# EAGLE design central__board (EAGLE 7.6.0)
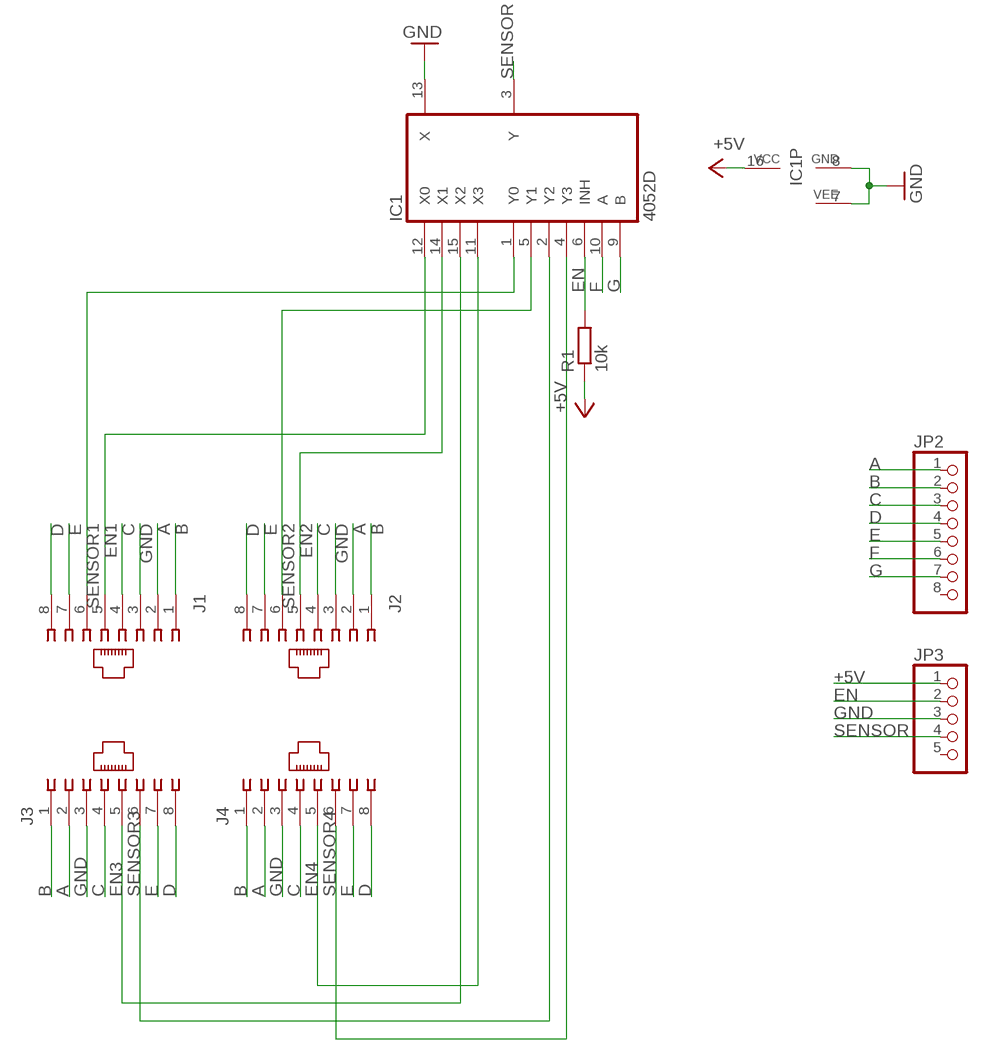
[diagram p0: schematic, sheet 1]

## Parts
IC1  4052D  [SO16]
J1  556416-1  [556416-1]
J2  556416-1  [556416-1]
J3  556416-1  [556416-1]
J4  556416-1  [556416-1]
JP2  PINHD-1X8  [1X08]
JP3  PINHD-1X5  [1X05]
R1  10k  R-EU_M1206  [M1206]

## Nets
+5V: IC1.16(VCC) JP3.1 R1.1
A: J1.2 J2.2 J3.2 J4.2 JP2.1
B: J1.1 J2.1 J3.1 J4.1 JP2.2
C: J1.4 J2.4 J3.4 J4.4 JP2.3
D: J1.8 J2.8 J3.8 J4.8 JP2.4
E: J1.7 J2.7 J3.7 J4.7 JP2.5
EN: IC1.6(INH) JP3.2 R1.2
EN1: IC1.12(X0) J1.5
EN2: IC1.14(X1) J2.5
EN3: IC1.15(X2) J3.5
EN4: IC1.11(X3) J4.5
F: IC1.10(A) JP2.6
G: IC1.9(B) JP2.7
GND: IC1.7(VEE) IC1.8(GND) IC1.13(X) J1.3 J2.3 J3.3 J4.3 JP3.3
SENSOR: IC1.3(Y) JP3.4
SENSOR1: IC1.1(Y0) J1.6
SENSOR2: IC1.5(Y1) J2.6
SENSOR3: IC1.2(Y2) J3.6
SENSOR4: IC1.4(Y3) J4.6
Unconnected: JP2.8 JP3.5

## Library data of the parts
IC1 = 40xx:4052: Dual 4-channel ANALOG MULTIPLEXER
J1-J4 = con-amp:556416-1: AMP connector
JP2 = pinhead:PINHD-1X8: PIN HEADER
JP3 = pinhead:PINHD-1X5: PIN HEADER
R1 = rcl:R-EU_: RESISTOR, European symbol

## Board
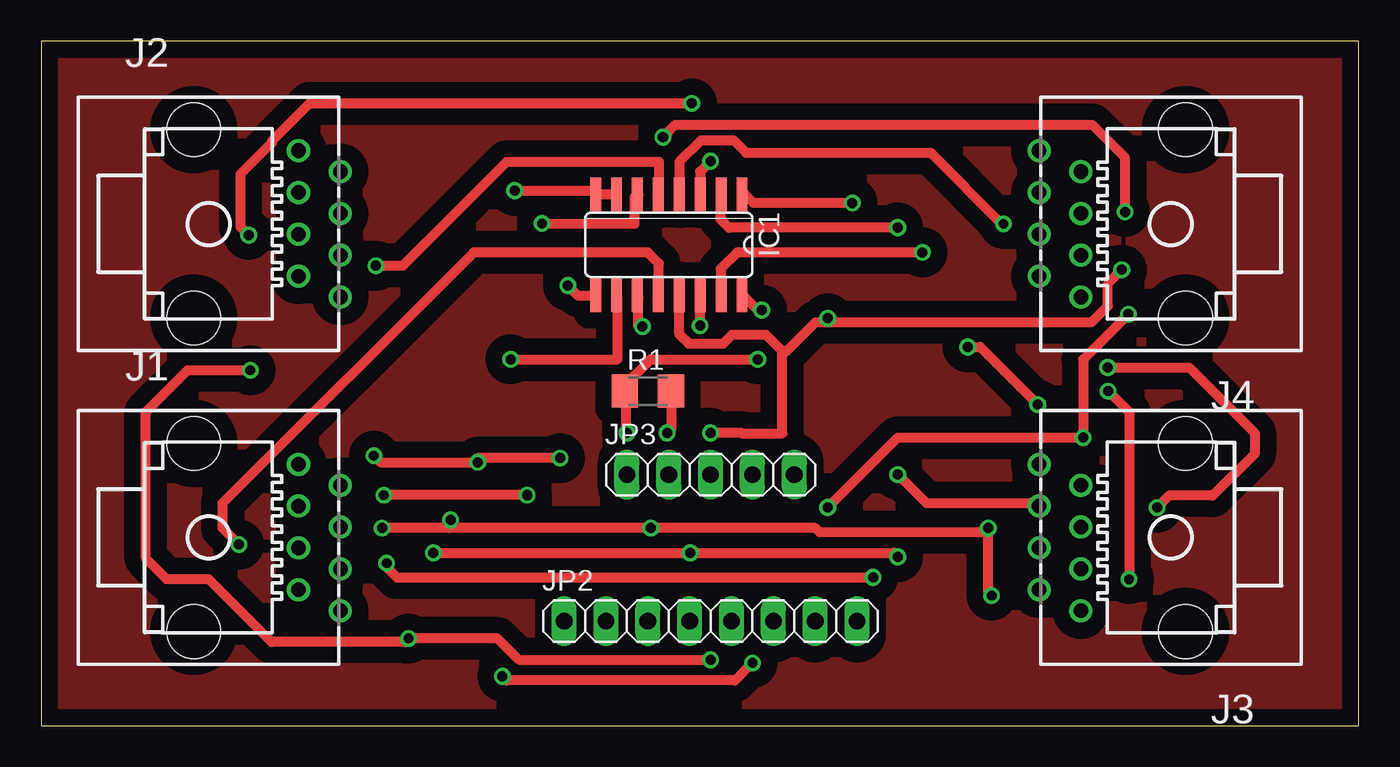
[diagram p1: board, top side]
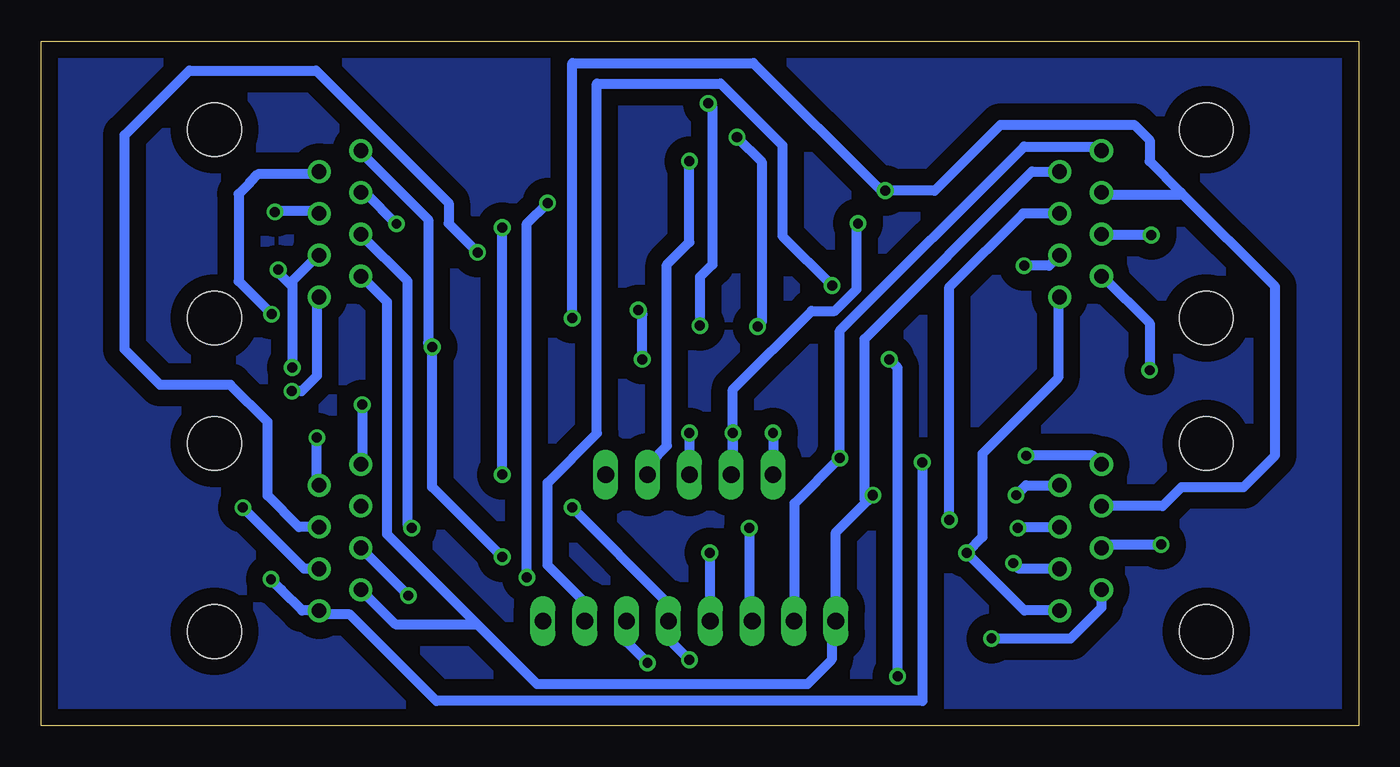
[diagram p2: board, bottom side, seen from below]

Size 79.99 x 41.58 mm. Coordinates in mm from the lower left corner, seen from the top.
Outline: 0,0 79.99,0 79.99,41.58 0,41.58 0,0
Copper layers (1*16): Top 0.035mm / dielectric 1.5mm / Bottom 0.035mm
Design rules "default *": minimum track width 24mil, minimum drill 24mil, track to track 20mil, track to pad 20mil, pad to pad 8mil, via to via 8mil, smd to smd 8mil, copper to edge 40mil, drill to drill 8mil, minimum pad ring 10mil, minimum via ring 8mil, stop-mask expansion 4mil, vias tented up to drill 0mil, thermal gap 10mil

### Footprints (pad centres in the part's own frame; a part is rotated, then mirrored left to right if it is on the bottom)
SO16 = smd 0.66 x 2.032: 1 -4.445,-3.073; 2 -3.175,-3.073; 3 -1.905,-3.073; 4 -0.635,-3.073; 5 0.635,-3.073; 6 1.905,-3.073; 7 3.175,-3.073; 8 4.445,-3.073; 9 4.445,3.073; 10 3.175,3.073; 11 1.905,3.073; 12 0.635,3.073; 13 -0.635,3.073; 14 -1.905,3.073; 15 -3.175,3.073; 16 -4.445,3.073
556416-1 = drill 0.889: 1 -4.445,5.461; 2 -3.175,8.001; 3 -1.905,5.461; 4 -0.635,8.001; 5 0.635,5.461; 6 1.905,8.001; 7 3.175,5.461; 8 4.445,8.001 | hole 3.251: -5.715,-0.889; 5.715,-0.889
1X08 = drill 1.016 long: 1 -8.89,0; 2 -6.35,0; 3 -3.81,0; 4 -1.27,0; 5 1.27,0; 6 3.81,0; 7 6.35,0; 8 8.89,0
1X05 = drill 1.016 long: 1 -5.08,0; 2 -2.54,0; 3 0,0; 4 2.54,0; 5 5.08,0
M1206 = smd 1.6 x 2: 1 -1.4,0; 2 1.4,0

### Placement (x,y rotation side)
IC1  38.1,29.21 180 top
J1  10.16,11.43 270 top
J2  10.16,30.48 270 top
J3  68.58,11.43 90 top
J4  68.58,30.48 90 top
JP2  40.64,6.35 0 top
JP3  40.64,15.24 0 top
R1  36.83,20.32 0 top

### Tracks (layer width: path | path; a pad name or v marks a point on that pad's centre or on a via)
+5V  (via drill 0.6, 0.61)
  Top 0.61: v43.75,25.25 43.5,25.25 42.75,26 IC1.16 | v43.5,22.25 37,22.25 35.25,20.5 R1.1 35.5,20.25 35.5,17.84 v35.56,17.78
  Bottom 0.61: v43.75,25.25 43.5,25 v43.5,22.25 | v35.56,17.78 JP3.1
A  (via drill 0.6, 0.61)
  Top 0.61: v29.5,14 v20.8,14
  Bottom 0.61: J4.2 60.5,27.25 59,25.75 59,11.64 53.52,6.17 | 29.88,13.62 31.75,11.75 JP2.1 32,6.25 32,4 33.46,2.54 49.9,2.54 53.52,6.17 | 29.88,13.62 v29.5,14 | 29.88,13.62 30,13.75 30,23.5 19.84,33.66 J2.2 | v20.8,14 20.2,14.61 J1.2 | J3.2 58.49,6.17 53.52,6.17
B  (via drill 0.6, 0.61)
  Top 0.61: v31.5,16.25 26.5,16.25 v26.5,16 20.6,16 v20.2,16.4 | v64.77,20.32 66.04,19.05 v66.04,8.89
  Bottom 0.61: J4.1 63.25,26 63.25,21.25 64.18,20.32 v64.77,20.32 | JP2.2 34.25,6.5 34.25,13.5 v31.5,16.25 31.5,24 20.32,35.18 15.88,35.18 J2.1 | v26.5,16 26.5,1.5 56,1.5 61.25,6.75 63,6.75 J3.1 63.25,7 64.15,7 65.41,8.26 v66.04,8.89 | J1.1 16.15,16.4 v20.2,16.4
C  (via drill 0.6, 0.61)
  Top 0.61: 24.75,12 v37,12 47,12 47.25,11.75 57.5,11.75 v57.5,12 57.5,8.1 v57.7,7.9 | v24.85,12.5 24.75,12 | 24.75,12 v20.7,12
  Bottom 0.61: v57.5,12 57.75,12.25 57.75,27 60.5,29.75 J4.4 | v37,12 37,6.5 JP2.3 | J2.4 20.39,31.11 24.85,26.65 v24.85,12.5 | v20.7,12 20.64,12.06 J1.4 | J3.4 57.7,7.92 v57.7,7.9
D  (via drill 0.61)
  Top 0.61: v60.5,19.5 57,23 v56.25,23 | v23.81,10.5 v39.4,10.5 51.75,10.5 v52,10.25
  Bottom 0.61: v60.5,19.5 60.5,16 J3.8 | J4.8 60.5,34.75 56.5,30.75 56.5,23.25 v56.25,23 56.25,14.5 v52,10.25 | J1.8 18.25,7 20.31,7 v23.81,10.5 22.86,11.45 22.86,16.51 18.25,21.12 18.25,26 J2.8 | v39.4,10.5 39.4,7.25 39.25,6.5 JP2.4
E  (via drill 0.6, 0.61)
  Top 0.61: v40.64,4 29,4 27.7,5.3 v22.3,5.3 22.08,5.08 13.97,5.08 10.16,8.89 7.62,8.89 6.35,10.16 6.35,19.05 8.89,21.59 v12.7,21.59 | v47.75,13.25 52,17.5 v63.25,17.5 63.25,22.25 65.58,24.59 v66,25
  Bottom 0.61: J2.7 15.5,27.25 12.7,24.45 v12.7,21.59 | v47.75,13.25 42,7.5 42,6.5 JP2.5 41.91,5.27 v40.64,4 | v22.3,5.3 17.5,5.3 15.62,7.18 J1.7 | J3.7 63.25,14.74 v63.25,17.5 | v66,25 68,27 68,32.3 67.31,32.99 67.31,33.02 66.83,33.5 63.25,33.5 63.25,33.52 J4.7
EN  (via drill 0.6)
  Top 0.61: R1.2 38.25,20.25 38.25,18.03 v38,17.78 | 36.25,32.25 IC1.6 36.02,32.11 36.02,30.48 30.92,30.48 v30.4,30.5
  Bottom 0.61: v38,17.78 38,15.25 JP3.2 38,15.34 v38,17.78 | v38,17.78 38,20.42 33.22,25.2 31.8,25.2 30.48,26.52 30.48,30.42 v30.4,30.5
EN1  (via drill 0.6)
  Top 0.61: IC1.12 37.5,26.25 37.5,28.08 36.83,28.75 26.25,28.75 11,13.5 11,12 v12,11
  Bottom 0.61: J1.5 15.42,11 v12,11
EN2  (via drill 0.6, 0.61)
  Top 0.61: 40,26.25 IC1.14 v40.01,24.3 v40,24.3 | v39.5,37.8 16.3,37.8 14,35.5 14,35.4 12.1,33.5 12.1,30.3 v12.6,29.8
  Bottom 0.61: v40,24.3 40,27.25 39.25,28 39.25,37.55 v39.5,37.8 | v12.6,29.8 15.58,29.8 J2.5
EN3  (via drill 0.61)
  Top 0.61: v53.5,28.75 42.25,28.75 41.25,27.75 41.25,26.25 IC1.15
  Bottom 0.61: v53.5,28.75 55.25,30.5 55.25,31.75 63.3,39.8 71,39.8 74.93,35.87 74.93,22.86 72.77,20.7 68.5,20.7 66.25,18.45 66.25,13.97 64.34,12.06 J3.5
EN4  (via drill 0.6, 0.61)
  Top 0.61: v36.5,24.25 36.25,24.25 36.25,26 IC1.11 | v37.75,35.75 38.5,36.5 63.8,36.5 65.8,34.5 v65.8,31.2
  Bottom 0.61: v36.5,24.25 36.25,24.5 36.25,34.25 v37.75,35.75 | J4.5 63.25,31.25 65.75,31.25 v65.8,31.2
F  (via drill 0.6, 0.61)
  Top 0.61: v28.5,22.25 35,22.25 35,26 IC1.10 | v28,3 28.25,2.75 42.12,2.75 v43.18,3.81
  Bottom 0.61: v28.5,22.25 28,21.75 v28,3 | JP2.6 44.45,5.08 v43.18,3.81
G  (via drill 0.61)
  Top 0.61: v31.98,26.73 32.57,26.14 IC1.9
  Bottom 0.61: v31.98,26.73 35,29.75 35,35.25 38.75,39 46.25,39 46.25,17.75 49.25,14.75 49.25,9.75 47,7.5 47,6.5 JP2.7
GND  (via drill 0.6, 0.61)
  Top 0.61: IC1.7 34.75,32.25 33.75,32.25 IC1.8 33.5,32.5 v28.75,32.5 | 45,22.75 44,23.75 41.95,23.75 41.4,23.2 39.3,23.2 38.75,23.75 38.75,26 IC1.13 | 45,22.75 45,17.75 42.5,17.75 42.47,17.78 v40.64,17.78 | 47.75,24.5 63.75,24.5 64.75,25.5 64.75,26.85 v65.6,27.7 | 47.75,24.5 47,24.5 45.25,22.75 45,22.75 | v47.75,24.75 47.75,24.5 | v64.75,21.75 69.69,21.75 73.66,17.78 73.66,16.51 71.12,13.97 68.47,13.97 v67.75,13.25
  Bottom 0.61: 15.5,32.5 J2.3 15.5,32.25 10.93,32.25 10.79,32.38 | 64.75,26.67 64.75,27 63.25,28.5 J4.3 | 64.75,26.67 v64.75,21.75 | v47.75,24.75 47.75,40.25 36.75,40.25 29,32.5 v28.75,32.5 25.75,32.5 21.75,36.5 13.64,36.5 12.7,35.56 12.7,34.29 10.79,32.38 | J1.3 11.91,13.34 10.75,14.5 7,14.5 5.08,16.42 5.08,26.67 10.79,32.38 | J3.3 64.03,9.53 v67.75,13.25 | v40.64,17.78 JP3.3 | v65.6,27.7 65.6,27.52 64.75,26.67
N$1
  pour Top (isolate 1): 0,0 80.01,0 80.01,41.91 0,41.91
N$2
  pour Bottom (isolate 1): 0,0 80.01,0 80.01,41.91 0,41.91
SENSOR  (via drill 0.6)
  Top 0.61: 40,32.25 IC1.3 40.01,33.66 v40.64,34.29
  Bottom 0.61: JP3.4 43,15.25 43,16 42,17 42,28 40.64,29.36 v40.64,34.29
SENSOR1  (via drill 0.6, 0.61)
  Top 0.61: v49.25,31.75 43.25,31.75 42.75,32.25 IC1.1 | v50.5,9 21.59,9 20.97,9.62 v20.97,9.87
  Bottom 0.61: v49.25,31.75 50.5,30.5 v50.5,9 | J1.6 20.62,9.53 v20.97,9.87
SENSOR2  (via drill 0.6)
  Top 0.61: IC1.5 37.5,32.5 37.5,34.25 28.25,34.25 21.94,27.94 v20.32,27.94
  Bottom 0.61: J2.6 18.8,27.94 v20.32,27.94
SENSOR3  (via drill 0.61)
  Top 0.61: v52,30.25 41.75,30.25 41.25,30.75 41.25,32.25 IC1.2 | v52,15.25 53.75,13.5 60.5,13.5 J3.6
  Bottom 0.61: v52,15.25 v52,30.25
SENSOR4  (via drill 0.6)
  Top 0.61: IC1.4 38.75,32.5 38.75,34.25 40.06,35.56 42.04,35.56 42.8,34.8 54,34.8 58.32,30.48 v58.42,30.48
  Bottom 0.61: J4.6 60.33,32.38 v58.42,30.48